# Altium schematic sheet Power.SchDoc
size A3
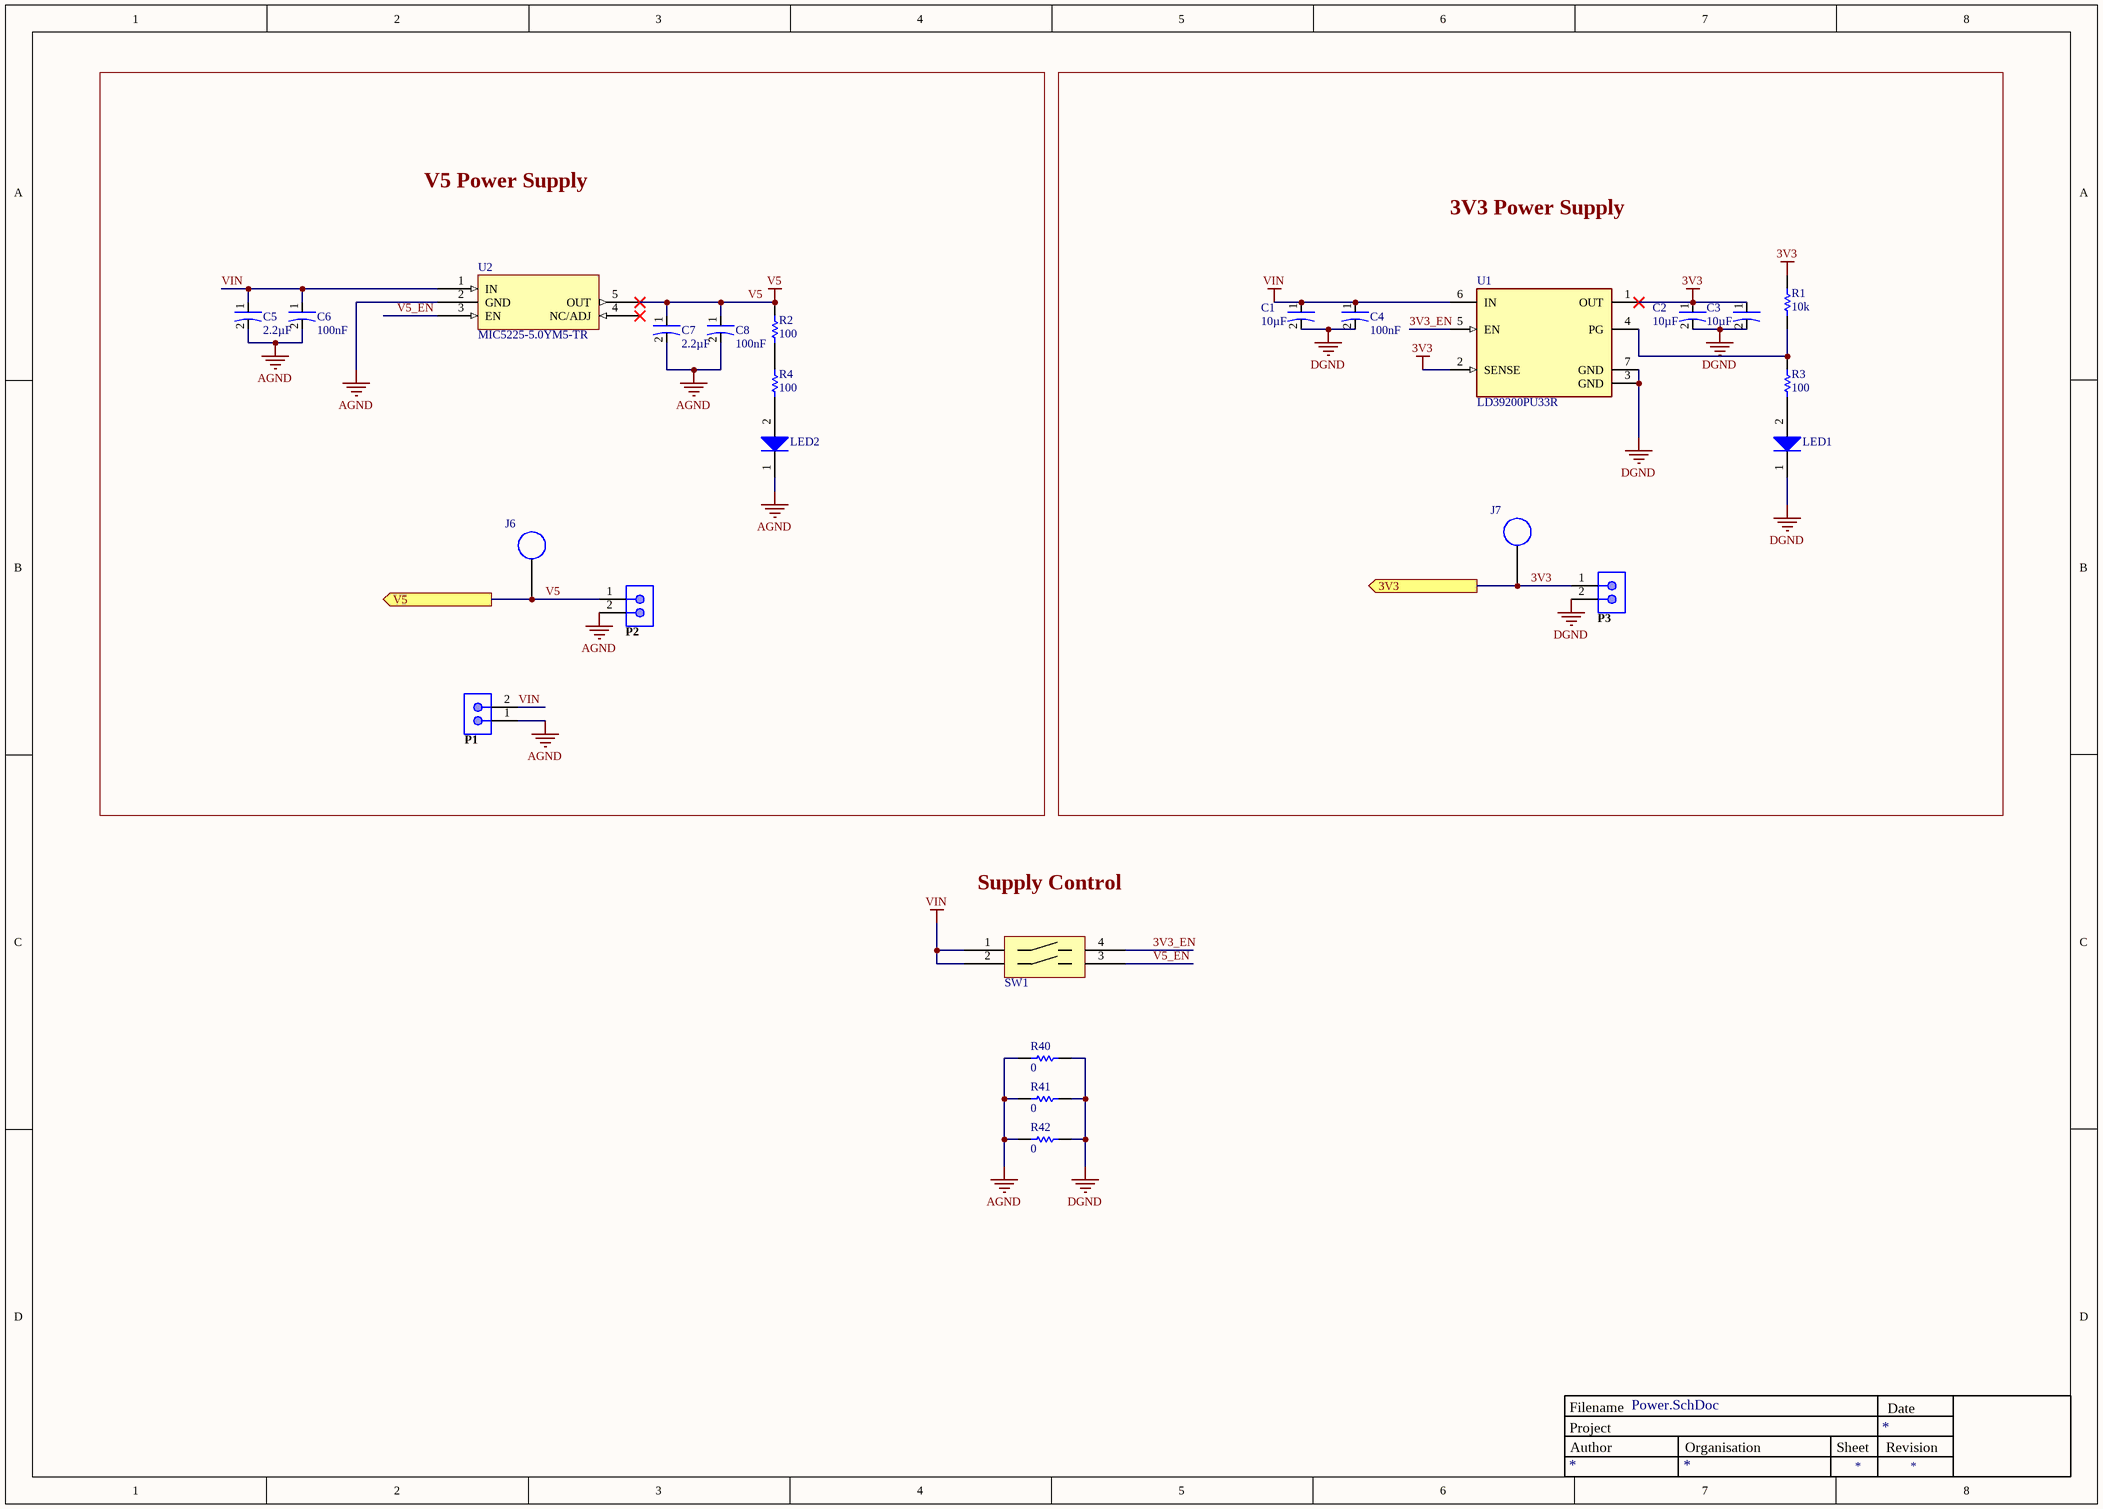
[diagram p0: Power.SchDoc]

## Parts
C1  value 10µF  [0402-M]  (hidden comment: CAP 10uF CER 0402 6.3V X5R 20%)
C2  value 10µF  [0402-M]  (hidden comment: CAP 10uF CER 0402 6.3V X5R 20%)
C3  value 10µF  [0402-M]  (hidden comment: CAP 10uF CER 0402 6.3V X5R 20%)
C4  value 100nF  [0402-M]  (hidden comment: CAP 0.1uF CER 0402 16V X5R 10%)
C5  value 2.2µF  [0402-M]  (hidden comment: CAP 2.2uF CER 0402 25V X5R 10%)
C6  value 100nF  [0402-M]  (hidden comment: CAP 0.1uF CER 0402 16V X5R 10%)
C7  value 2.2µF  [0402-M]  (hidden comment: CAP 2.2uF CER 0402 25V X5R 10%)
C8  value 100nF  [0402-M]  (hidden comment: CAP 0.1uF CER 0402 16V X5R 10%)
J6  151-203-RC  [151-203-RC-Footprint-1]  (value not drawn)
J7  151-203-RC  [151-203-RC-Footprint-1]  (value not drawn)
LED1  LED 0603 Green 20mA 1.8V  [0603 Generic]  (value not drawn)
LED2  LED 0603 Green 20mA 1.8V  [0603 Generic]  (value not drawn)
P1  GENERIC 2PIN HEADER MALE  [GENERIC 2PIN HEADER 0]  (value not drawn)
P2  GENERIC 2PIN HEADER MALE  [GENERIC 2PIN HEADER 0]  (value not drawn)
P3  GENERIC 2PIN HEADER MALE  [GENERIC 2PIN HEADER 0]  (value not drawn)
R1  value 10k  [0402-M]  (hidden comment: RES 10k 0402 63mW 5%)
R2  value 100  [0805-L]  (hidden comment: RES 100 0805 125mW 1%)
R3  value 100  [0805-L]  (hidden comment: RES 100 0805 125mW 1%)
R4  value 100  [0805-L]  (hidden comment: RES 100 0805 125mW 1%)
R40  value 0  [0402-M]  (hidden comment: RES 0 0402 63mW)
R41  value 0  [0402-M]  (hidden comment: RES 0 0402 63mW)
R42  value 0  [0402-M]  (hidden comment: RES 0 0402 63mW)
SW1  210-2MS  [210-2MS-Footprint-1]  (value not drawn)
U1  LD39200PU33R  [FP-DFN6-7946637-MFG]
U2  MIC5225-5.0YM5-TR  [SOT95P280X145-5N]

## Blocks framed on the sheet
V5 Power Supply: C5-C8 J6 LED2 P1 P2 R2 R4 U2
3V3 Power Supply: C1-C4 J7 LED1 P3 R1 R3 U1

## Ports
3V3 (out), V5 (out)

## Nets
3V3: C2.1(Anode) C3.1(Anode) J7.1 P3.1 R1.2 U1.1(OUT) U1.2(SENSE) ; port 3V3
AGND: C5.2(Cathode) C6.2(Cathode) C7.2(Cathode) C8.2(Cathode) LED2.1 P1.1 P2.2 R40.1 R41.1 R42.1 U2.2(GND)
DGND: C1.2(Cathode) C2.2(Cathode) C3.2(Cathode) C4.2(Cathode) LED1.1 P3.2 R40.2 R41.2 R42.2 U1.3(GND) U1.7(GND)
V5: C7.1(Anode) C8.1(Anode) J6.1 P2.1 R2.2 U2.5(OUT) ; port V5
VIN: C1.1(Anode) C4.1(Anode) C5.1(Anode) C6.1(Anode) P1.2 SW1.1 SW1.2 U1.6(IN) U2.1(IN)
3V3_EN: SW1.4 U1.5(EN)
V5_EN: SW1.3 U2.3(EN)
NetLED1_2: LED1.2 R3.1
NetLED2_2: LED2.2 R4.1
NetR1_1: R1.1 R3.2 U1.4(PG)
NetR2_1: R2.1 R4.2

Not connected (* = marked no-connect by the designer): U2 4(NC/ADJ)*

## Notes on the sheet
- Supply Control
- Project
- Filename
- Author
- Organisation
- Sheet
- Revision
- Date
  Date

## Library data of the parts
C1-C3 = CAP 10uF CER 0402 6.3V X5R 20%-2: CAP-10uF-CER-0402-6.3V-X5R-20%; Manufacturer: Generic; Type: SMD; Bin: F1-C2-10; Supplier Part Number 1: 80-C0402C106M9P; Source: Capacitor Library.SchLib; Case/Package: 0402; Supplier 1: Mouser; Design Item ID: CAP 10uF CER 0402 6.3V X5R 20%
C4 C6 C8 = CAP 0.1uF CER 0402 16V X5R 10%-2: CAP-0.1uF-CER-0402-16V-X5R-10%; Manufacturer: Generic; Bin: CAP1-M1; Type: SMD; Source: Capacitor Library.SchLib; Status: Active; Design Item ID: CAP 0.1uF CER 0402 16V X5R 10%; Supplier 1: Mouser; Supplier Part Number 1: 810-CGA2B2X5R1C104KA; Case/Package: 0402
C5 C7 = CAP 2.2uF CER 0402 25V X5R 10%-2: CAP-2.2uF-CER-0402-25V-X5R-10%; Manufacturer: Generic; Bin: F1-C1-9; Type: SMD; Supplier Part Number 1: 810-C1005X5R1E225K; Status: Active; Supplier 1: Mouser; Source: Capacitor Library.SchLib; Design Item ID: CAP 2.2uF CER 0402 25V X5R 10%; Case/Package: 0402
J6 J7 = CMP-002-00000-2: PCB-Probe-Ring; Color: Black
LED1 LED2 = LED 0603 Green 20mA 1.8V-1: LED-0603-Green-20mA-1.8V-STOCK; Manufacturer: Generic; Bin: F2-DM1-1; Type: SMD; Design Item ID: LED 0603 Green 20mA 1.8V; Status: Active; Supplier 1: Mouser; Supplier Part Number 1: 645-598-8060-107F; Case/Package: 0603; Source: Diode Library.SchLib
P1-P3 = GENERIC 2PIN HEADER MALE-2: CONN MAL TH 2 0Deg HEADER; Bin: B3-J5; Manufacturer: Generic; Design Item ID: GENERIC 2PIN HEADER MALE; Type: TH; Status: Active; Source: Connector Library.SchLib; Case/Package: n/a PIN
R1 = RES 10k 0402 63mW 5%-1: RES-10k-0402-63mW-5%; Manufacturer: Generic; Bin: F1-R7-9; MAPPING: 1(2,1,11.5k); Design Item ID: RES 10k 0402 63mW 5%; Type: SMD; Status: Active; Case/Package: 0402; Source: Resistor Library.SchLib
R2-R4 = RES 100 0805 125mW 1%-1: RES-100-0805-125mW-1%; Manufacturer: Generic; Bin: F1-R11-6; MAPPING: 1(2,1,10k); Status: Active; Case/Package: 0805; Source: Resistor Library.SchLib; Type: SMD; Design Item ID: RES 100 0805 125mW 1%
R40-R42 = RES 0 0402 63mW-1: RES-0-0402-63mW-5%; Manufacturer: Generic; MAPPING: 1(2,1,11.5k); Bin: F1-RM1-5; Source: Resistor Library.SchLib; Design Item ID: RES 0 0402 63mW; Case/Package: 0402; Type: SMD; Status: Active
SW1 = CMP-01293-3: SWITCH DIP SPST 2 100mA 50V; Actuator Type: Slide (Standard); Electrical Life: 1000Cycles; Number of Positions: 2; Washable: No; Pitch: 0.1inch; Voltage Rating (DC): 20V; Terminal Pitch: 2.54mm; Contact Material: Copper; Length: 0.258inch; Termination: PC Pin; Lead Free: Lead Free; Max Current Rating: 100mA; Throw Configuration: SPST; Packaging: Rail/Tube; Current Rating: 100mA; Orientation: Straight; Min Operating Temperature: -40°C; Contact Plating: Gold,Tin; Max Operating Temperature: 85°C; Package Quantity: 85; Mount: Through Hole
U1 = CMP-01296-3: STMICROELECTRONICS - LD39200PU33R - LDO, FIXED, 3.3V, 2A, -40 TO 125DEG C; Bin: NR; Case/Package: 6-pin DFN; Manufacturer: STMicroelectronics; Status: NR; Supplier1: NR; Supplier Part Number1: NR; Type: SMD
U2 = CMP-01298-1: MICROCHIP - MIC5225-5.0YM5-TR - Fixed LDO Voltage Regulator, 2.3V to 16V, 310mV Dropout, 5Vout, 150mAout, SOT-23-5; Output Current: 150mA; Number of Regulators: 1; Output Voltage: 5V; Min Input Voltage: 2.3V; Mount: Surface Mount; Min Operating Temperature: -40°C; Max Operating Temperature: 125°C; Number of Pins: 5; Lead Free: Lead Free; Dropout Voltage: 310mV; Max Input Voltage: 16V; REACH SVHC: No SVHC; Case/Package: SOT-23-5; Packaging: Cut Tape; Output Type: Fixed; Nominal Output Voltage: 5V